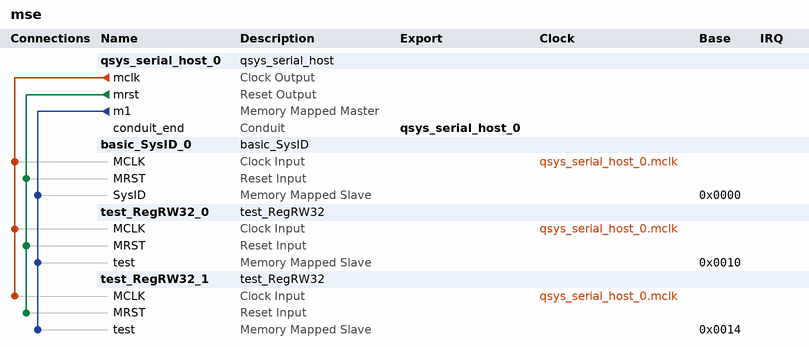
[diagram p0: system contents]
# Platform Designer (Qsys) system mse, Cyclone IV E EP4CE15F23C8
# Parameters at their usual value, and those the tool derives, are not listed.
package require qsys
create_system mse
set_project_property DEVICE_FAMILY {Cyclone IV E}
set_project_property DEVICE EP4CE15F23C8

add_instance qsys_serial_host_0 qsys_serial_host 1.0
set_instance_parameter_value qsys_serial_host_0 initial_state 0

add_instance basic_SysID_0 basic_SysID 1.0

add_instance test_RegRW32_0 test_RegRW32 1.0

add_instance test_RegRW32_1 test_RegRW32 1.0

# connections
add_connection qsys_serial_host_0.mclk basic_SysID_0.MCLK clock
add_connection qsys_serial_host_0.mclk test_RegRW32_0.MCLK clock
add_connection qsys_serial_host_0.mclk test_RegRW32_1.MCLK clock
add_connection qsys_serial_host_0.mrst basic_SysID_0.MRST reset
add_connection qsys_serial_host_0.mrst test_RegRW32_0.MRST reset
add_connection qsys_serial_host_0.mrst test_RegRW32_1.MRST reset
add_connection qsys_serial_host_0.m1 basic_SysID_0.SysID avalon
set_connection_parameter_value qsys_serial_host_0.m1/basic_SysID_0.SysID baseAddress 0x0000
add_connection qsys_serial_host_0.m1 test_RegRW32_0.test avalon
set_connection_parameter_value qsys_serial_host_0.m1/test_RegRW32_0.test baseAddress 0x0010
add_connection qsys_serial_host_0.m1 test_RegRW32_1.test avalon
set_connection_parameter_value qsys_serial_host_0.m1/test_RegRW32_1.test baseAddress 0x0014

# exported interfaces
add_interface qsys_serial_host_0 conduit end
set_interface_property qsys_serial_host_0 EXPORT_OF qsys_serial_host_0.conduit_end

save_system mse.qsys
